# Altium project WzmPot.PrjPCB
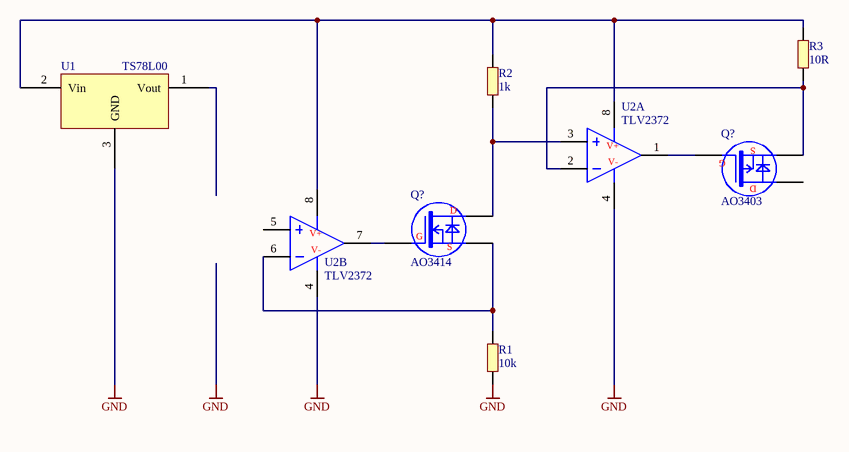
[diagram p0: WzmPotV1.SchDoc]
1 sheet, 7 parts. Net scope: global (net labels, ports and power ports of the same name join across sheets).
Board file: WzmPotV1.PcbDoc

## Sheet WzmPotV1.SchDoc
size A4

### Parts
(Parts that share a designator on the sheet are numbered #1, #2 ... from top to bottom, then left to right.)
Q?#1  AO3403  [SOT23]
Q?#2  AO3414  [SOT23]
R1  10k  [0603R]
R2  1k  [0603R]
R3  10R  [0603R]
U1  TS78L00  [SOT23]
U2  TLV2372  [SO8]  (parts A,B of 2)

### Nets
GND: R1.2 U1.3(GND) U2.4
NetQ?#1_1: Q?#1.1(G) U2.1
NetQ?#1_2: Q?#1.2(S) R3.2 U2.2
NetQ?#2_1: Q?#2.1(G) U2.7
NetQ?#2_2: Q?#2.2(S) R1.1 U2.6
NetQ?#2_3: Q?#2.3(D) R2.2 U2.3
NetR2_1: R2.1 R3.1 U1.2(Vin) U2.8

Not connected (* = marked no-connect by the designer): Q?#1 3(D); U1 1(Vout); U2 5

### Notes on the sheet
- (in symbol WzmOp2, part A) V+; V-
- (in symbol WzmOp2, part B) V+; V-

### Library data of the parts
Q?#1 = MOSFET-P
Q?#2 = MOSFET-N
R1-R3 = RES3
U1 = 78M05
U2 = WzmOp2